# EAGLE design AKU350-Silicon-Mic_Rev-A (EAGLE 8.0.0)
COMPANY: ADAFRUIT INDUSTRIES; DRAWN: KTOWN; REV: A
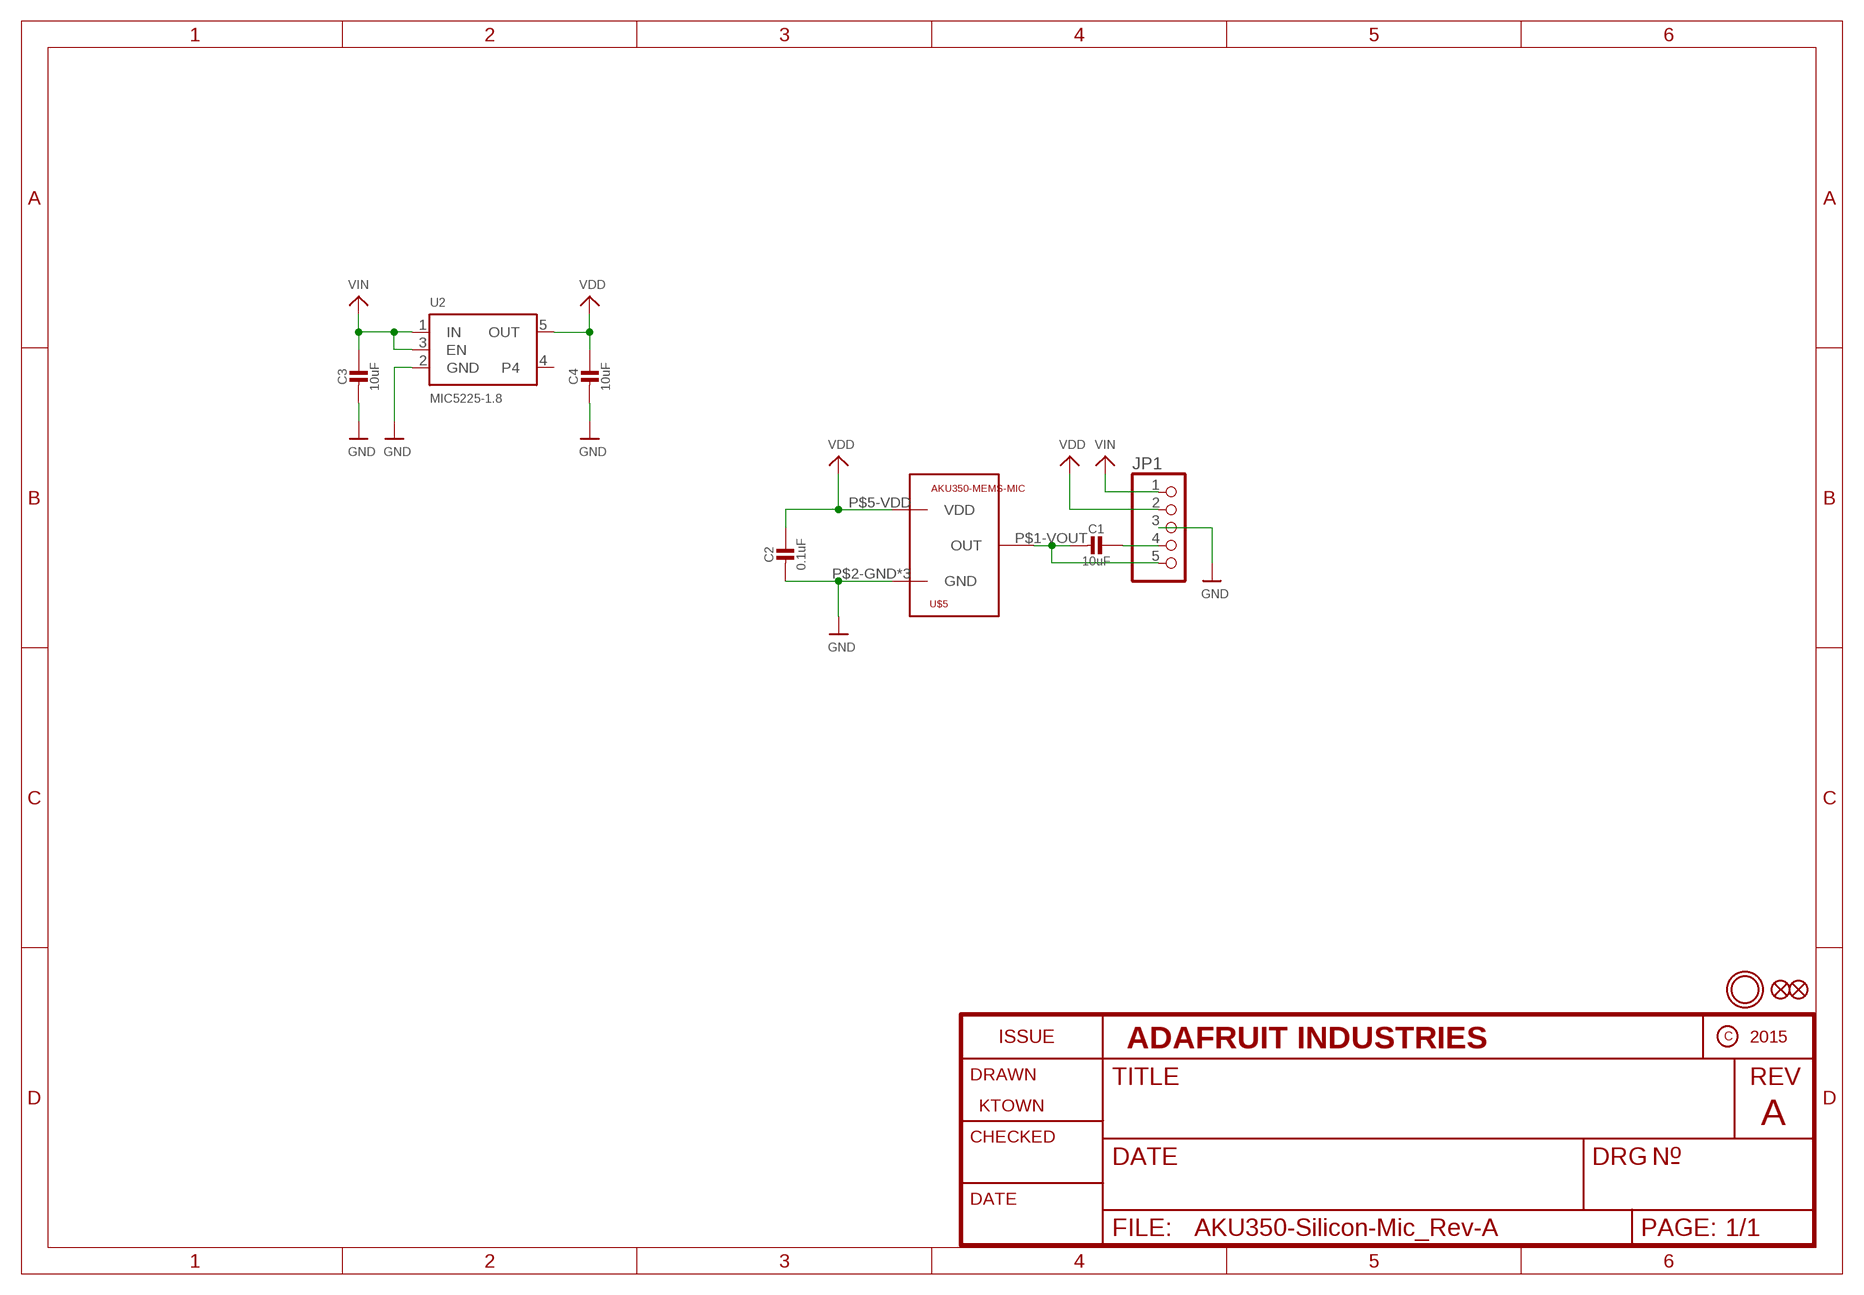
[diagram p0: schematic, sheet 1]

## Parts
C1  10uF  CAP_CERAMIC0805-NOOUTLINE  [0805-NO]
C2  0.1uF  CAP_CERAMIC0805-NOOUTLINE  [0805-NO]
C3  10uF  CAP_CERAMIC0805-NOOUTLINE  [0805-NO]
C4  10uF  CAP_CERAMIC0805-NOOUTLINE  [0805-NO]
FID1  FIDUCIAL""  [FIDUCIAL_1MM]
FID2  FIDUCIAL""  [FIDUCIAL_1MM]
JP1  HEADER-1X576MIL  [1X05_ROUND_76]
U2  MIC5225-1.8  VREG_SOT23-5  [SOT23-5]
U$5  AKU350-MEMS-MIC  [AKU350-MEMS-MIC]
U$12  MOUNTINGHOLE2.5  [MOUNTINGHOLE_2.5_PLATED]

## Nets
GND: C2.2 C3.2 C4.2 JP1.3 U2.2(GND) U$5.P$2-GND(GND) U$5.P$3-GND(GND) U$5.P$4-GND(GND)
N$1: C1.2 JP1.5 U$5.P$1-VOUT(OUT)
N$2: C1.1 JP1.4
VDD: C2.1 C4.1 JP1.2 U2.5(OUT) U$5.P$5-VDD(VDD)
VIN: C3.1 JP1.1 U2.1(IN) U2.3(EN)
Unconnected: U2.4

## Library data of the parts
C1-C4 = microbuilder:CAP_CERAMIC: Ceramic Capacitors For new designs, use the packages preceded by an '_' character since they are more reliable: The following footprints should be used on most boards: _0402 - Standard footprint for regular board layouts _0603 - Standard footprint for regular board layouts _0805 - Standard footprint for regular board layouts _1206 - Standard footprint for regular board layouts For extremely tight-pitch boards where space is at a premium, the following 'micro-pitch' footprints can be used (smaller pads, no silkscreen outline, etc.): _0402MP - Micro-pitch footprint for very dense/compact boards _0603MP - Micro-pitch footprint for very dense/compact boards _0805MP - Micro-pitch footprint for very dense/compact boards _1206MP - Micro-pitch footprint for very dense/compact boards
FID1 FID2 = microbuilder:FIDUCIAL: Fiducial Alignment Points Various fiducial points for machine vision alignment.; BOM: EXCLUDE
JP1 = microbuilder:HEADER-1X5: PIN HEADER
U2 = microbuilder:VREG_SOT23-5: SOT23-5 Fixed Voltage Regulators Part Current Out V Out V In V Dropout θJA (°C/W) TJ (°C) Digikey Part No. ADP121 150mA 3.3V 3.4-5.5V 0.09V @ 150mA -- -- ADP121-AUJZ33R7CT-ND ADP121 150mA 3.0V 3.1-5.5V 0.09V @ 150mA -- -- ADP121-AUJZ30R7CT-ND ADP122 300mA 3.3V 3.4-5.5V 0.085V @ 300mA -- -- ADP122AUJZ-3.3-R7CT-ND ADP1712 300mA 3.3V 3.5-5.5V 0.17V @ 300mA -- -- ADP1712AUJZ-3.3-R7TR-ND AP7311 (Low Cost) 150mA 3.3V 3.5-6V 0.15V @ 150mA -- -- AP7311-33WG-7DICT-ND LD39015M18R 150mA 1.8V 1.9V-5.5V 0.08V @ 100mA -- -- 497-6977-1-ND LP2985A-33DBVR 150mA 3.3V 3.3-16V 0.28V @ 150mA 206 150 296-18479-1-ND MCP1824T-3302E/OT 300mA 3.3V 3.5V-6V 0.2V @ 300mA -- -- MCP1824T-3302E/OTCT-ND MIC5205-2.5YM5 TR 150mA 2.5V 2.7-16V 0.165V @ 150mA -- -- 576-1257-2-ND MIC5205-3.0YM5 TR 150mA 3.0V 3.2V-16V 0.165V @ 150mA -- -- 576-1258-2-ND MIC5205-3.3YM5 TR 150mA 3.3V 3.5V-16V 0.165V @ 150mA -- -- 576-1259-2-ND TPS780330220 150mA 3.3V+2.2V 3.6-5.5V 250mV Max -- -- 296-23332-1-ND TDA3663/N1,135 100mA 3.3V 3.5-45V 0.18V @ 50mA -- -- 568-5343-1-ND Max operating temp can be calculated using θJA, TJ (max junction temperature), and power in watts. Set the "Maximum Ambient Temperature" until it reaches TJ ("Max Junction Temperature"), which is the absolute limit for safe use of the regulator: Heat Sink Temperature Calculator <http://www.daycounter.com/Calculators/Heat-Sink-Temperature-Calculator.phtml> For example, With 12V source into a 3.3V LP2985 and a 30mA load, we are dissipating (12V-3.3V) * 0.03A = 0.261W. With a θJA of 206 °C/W, a TJ of 150°C, and 261mW we can safely use the chip without a heat sink up to 75°C (=147.1°C Junction Temperature).
U$5 = CMU-ArtFab:AKU350-MEMS-MIC
U$12 = microbuilder:MOUNTINGHOLE: Mounting Hole For #2 screws (0.086"/2.18mm width, 0.094"/2.4mm hole) use 2.5mm; BOM: EXCLUDE

## Board
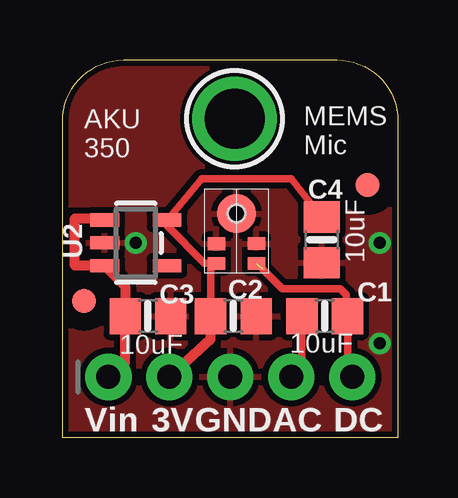
[diagram p1: board, top side]
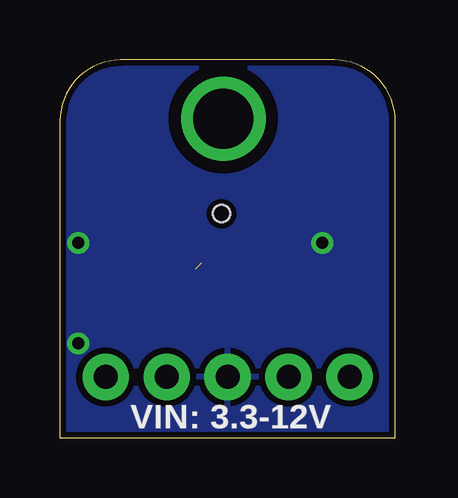
[diagram p2: board, bottom side, seen from below]

Size 13.97 x 15.75 mm. Coordinates in mm from the lower left corner, seen from the top.
Outline: 0,0 0,13.21 arc-90 2.54,15.75 11.43,15.75 arc-90 13.97,13.21 13.97,0 0,0
Copper layers (1*16): Top 0.035mm / dielectric 1.5mm / Bottom 0.035mm
Design rules "adafruit": minimum track width 8mil, minimum drill 15.5mil, track to track 8mil, track to pad 8mil, pad to pad 8mil, via to via 8mil, smd to smd 8mil, copper to edge 10mil, drill to drill 8mil, minimum pad ring 10mil, minimum via ring 8mil, stop-mask expansion 2mil, vias tented up to drill 20mil, thermal gap 10mil

### Footprints (pad centres in the part's own frame; a part is rotated, then mirrored left to right if it is on the bottom)
0805-NO = smd 1.3 x 1.5: 1 -0.95,0; 2 0.95,0
FIDUCIAL_1MM = smd 1 x 1: 1 0,0
1X05_ROUND_76 = drill 1 pad 1.93: 1 -5.08,0; 2 -2.54,0; 3 0,0; 4 2.54,0; 5 5.08,0
SOT23-5 = smd 0.55 x 1.2: 1 -0.95,-1.3; 2 0,-1.3; 3 0.95,-1.3; 4 0.95,1.3; 5 -0.95,1.3
AKU350-MEMS-MIC = smd 0.725 x 0.525: P$1-VOUT -0.836,1.366; P$2-GND -0.837,0.537; P$4-GND 0.836,0.543; P$5-VDD 0.836,1.364 | smd 1.625 x 1.625: P$3-GND 0,-0.71 | hole 0.71: 0,-0.71
MOUNTINGHOLE_2.5_PLATED = drill 2.5 pad 3.2: P$1 0,0

### Placement (x,y rotation side)
C1  10.92,5.08 0 top
C2  7.11,5.08 0 top
C3  3.56,5.08 0 top
C4  10.79,8.26 270 top
FID1  0.89,5.71 0 top
FID2  12.7,10.54 0 top
JP1  6.99,2.54 0 top
U2  3.05,8.13 270 top
U$5  7.24,8.64 180 top
U$12  7.16,13.3 0 top

### Tracks (layer width: path | path; a pad name or v marks a point on that pad's centre or on a via)
GND  (via drill 0.5)
  other vias: 13.21,8.13 13.21,3.94 3.05,8.13
  pour Top (isolate 0.254): 0,0 0,15.88 13.97,15.88 13.97,0
  pour Bottom (isolate 0.254): 0,0.25 0,15.88 13.97,15.88 13.97,0
N$1  (1 unrouted)
  Top 0.305: 8.33,7.03 9.14,6.22 11.56,6.22 11.81,5.97 11.81,5.14 C1.2 11.87,2.86 JP1.5
N$2
  Top 0.305: C1.1 9.97,2.86 JP1.4
VDD
  Top 0.305: 6.27,5.18 arc-90 C2.1 6.16,7.03 U$5.P$5-VDD 5.91,7.27 4.35,8.83 U2.5 5.79,10.81 9.52,10.81 C4.1
  Top 0.406: 4.39,9.08 U2.5 | JP1.2 6.16,4.13 C2.1 6.44,5.36
VIN
  Top 0.406: JP1.1 2.61,3.11 C3.1 2.61,6.32 U2.3 0.51,7.18 0.51,9.14 1.75,9.14 U2.1

### Text on the board
tPlace: AKU / 350 | MEMS / Mic | Vin | 3V | GND | AC | DC
bPlace: VIN: 3.3-12V